# Altium schematic sheet DK_MOTO.SchDoc
size A4
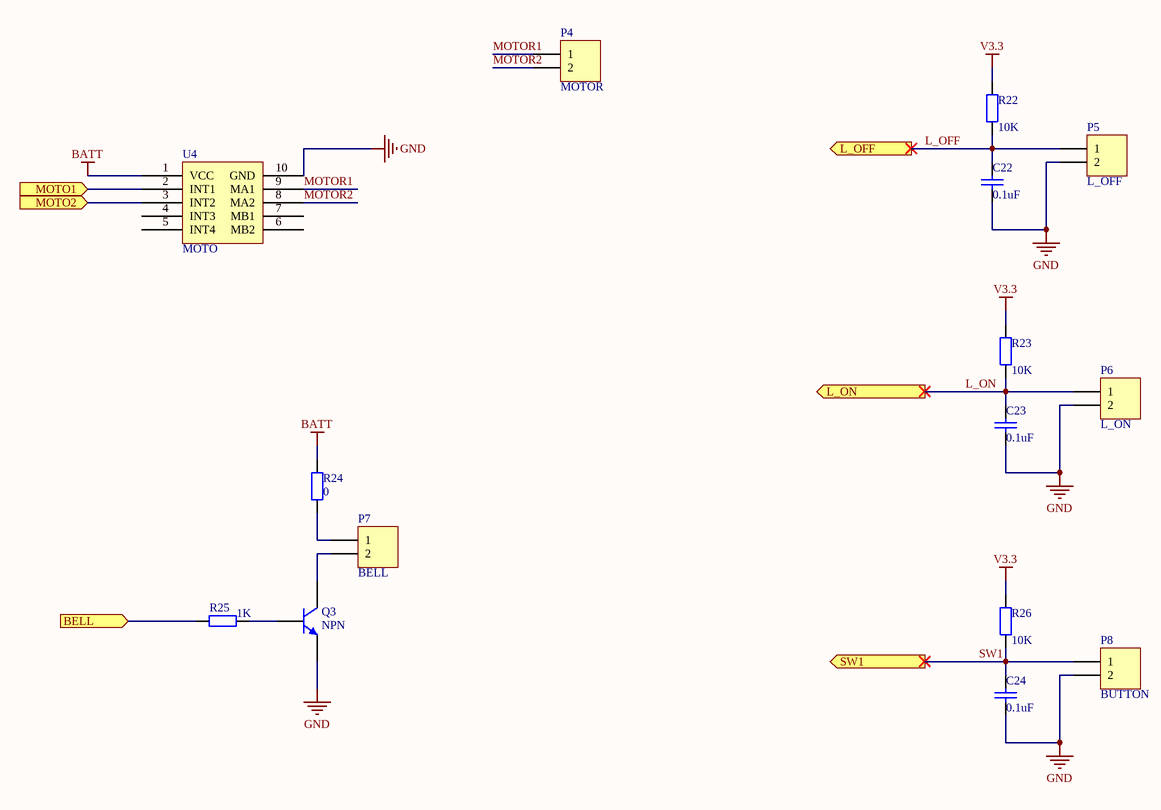
[diagram p0: DK_MOTO.SchDoc]

## Parts
C22  value 0.1uF  [0603]  (hidden comment: Cap)
C23  value 0.1uF  [0603]  (hidden comment: Cap)
C24  value 0.1uF  [0603]  (hidden comment: Cap)
P4  MOTOR  [COM2]
P5  L_OFF  [COM2]
P6  L_ON  [COM2]
P7  BELL  [COM2]
P8  BUTTON  [COM2]
Q3  NPN  [SOT-23A]
R22  value 10K  [0603]  (hidden comment: Res2)
R23  value 10K  [0603]  (hidden comment: Res2)
R24  value 0  [0603]  (hidden comment: Res2)
R25  value 1K  [0603]  (hidden comment: Res2)
R26  value 10K  [0603]  (hidden comment: Res2)
U4  MOTO  [MOTO2]

## Ports
BELL (in), L_OFF (out), L_ON (out), MOTO1 (in), MOTO2 (in), SW1 (out)

## Nets
BATT: R24.2 U4.1(VCC)
GND: C22.1 C23.1 C24.1 P5.2 P6.2 P8.2 Q3.3(E) U4.10(GND)
V3.3: R22.2 R23.2 R26.2
BELL: R25.1 ; port BELL
L_OFF: C22.2 P5.1 R22.1 ; port L_OFF
L_ON: C23.2 P6.1 R23.1 ; port L_ON
MOTO1: U4.2(INT1) ; port MOTO1
MOTO2: U4.3(INT2) ; port MOTO2
MOTOR1: P4.1 U4.9(MA1)
MOTOR2: P4.2 U4.8(MA2)
SW1: C24.2 P8.1 R26.1 ; port SW1
NetP7_1: P7.1 R24.1
NetP7_2: P7.2 Q3.1(C)
NetQ3_2: Q3.2(B) R25.2

Not connected (* = marked no-connect by the designer): U4 4(INT3) 5(INT4) 6(MB2) 7(MB1)

## Library data of the parts
C22-C24 = Cap: Capacitor; Published: 8-Jun-2000; LatestRevisionDate: 17-Jul-2002; LatestRevisionNote: Re-released for DXP Platform.; PackageReference: RAD-0.3; Publisher: Altium Limited; PackageDescription: Radial Cap, Thru-Hole; 2 Leads; 0.3 in Pin Spacing
P4-P8 = Header 2: Header, 2-Pin; LatestRevisionDate: 17-Jul-2002; LatestRevisionNote: Re-released for DXP Platform.; Publisher: Altium Limited
Q3 = NPN: NPN Bipolar Transistor; Published: 8-Jun-2000; LatestRevisionDate: 17-Jul-2002; LatestRevisionNote: Re-released for DXP Platform.; PackageReference: TO-226-AA; Publisher: Altium Limited; PackageDescription: TO, Flat Index; 3 In-Line, Axial Leads; Body Dia. 4.8mm; Leads 0.55 x 0.51 mm (max); Code_JEDEC: TO-226-AA
R22-R26 = Res2: Resistor; Published: 8-Jun-2000; LatestRevisionDate: 17-Jul-2002; LatestRevisionNote: Re-released for DXP Platform.; PackageReference: AXIAL-0.4; Publisher: Altium Limited; PackageDescription: Axial Device, Thru-Hole; 2 Leads; 0.4 in Pin Spacing